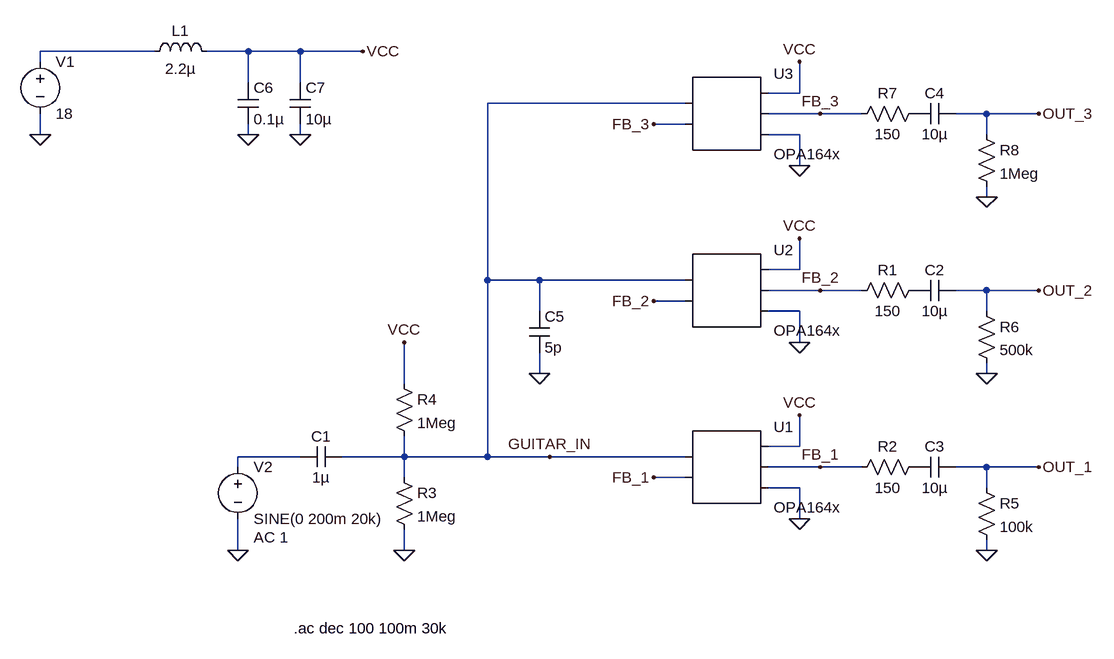
[diagram p0: schematic buffer.asc]
buffer.asc, the LTspice schematic file:
Version 4
SHEET 1 880 680
WIRE -736 -480 -912 -480
WIRE -592 -480 -656 -480
WIRE -512 -480 -592 -480
WIRE -416 -480 -512 -480
WIRE -912 -464 -912 -480
WIRE -592 -432 -592 -480
WIRE -512 -432 -512 -480
WIRE 256 -416 256 -464
WIRE 256 -416 208 -416
WIRE 80 -400 -224 -400
WIRE 288 -384 208 -384
WIRE 352 -384 288 -384
WIRE 544 -384 496 -384
WIRE 624 -384 544 -384
WIRE 80 -368 32 -368
WIRE -912 -352 -912 -384
WIRE -592 -352 -592 -368
WIRE -512 -352 -512 -368
WIRE 256 -352 208 -352
WIRE 544 -352 544 -384
WIRE 256 -304 256 -352
WIRE 544 -256 544 -272
WIRE 256 -144 256 -192
WIRE 256 -144 208 -144
WIRE -224 -128 -224 -400
WIRE -144 -128 -224 -128
WIRE 80 -128 -144 -128
WIRE 288 -112 208 -112
WIRE 352 -112 288 -112
WIRE 544 -112 496 -112
WIRE 624 -112 544 -112
WIRE 80 -96 32 -96
WIRE -144 -80 -144 -128
WIRE 256 -80 208 -80
WIRE 544 -80 544 -112
WIRE 256 -32 256 -80
WIRE -144 16 -144 -16
WIRE 544 16 544 0
WIRE -352 32 -352 -32
WIRE 256 128 256 80
WIRE 256 128 208 128
WIRE -512 144 -608 144
WIRE -352 144 -352 112
WIRE -352 144 -448 144
WIRE -224 144 -224 -128
WIRE -224 144 -352 144
WIRE -128 144 -224 144
WIRE 80 144 -128 144
WIRE -608 160 -608 144
WIRE 288 160 208 160
WIRE 352 160 288 160
WIRE 544 160 496 160
WIRE 624 160 544 160
WIRE -352 176 -352 144
WIRE 80 176 32 176
WIRE 256 192 208 192
WIRE 544 192 544 160
WIRE 256 240 256 192
WIRE -608 288 -608 240
WIRE -352 288 -352 256
WIRE 544 288 544 272
FLAG -912 -352 0
FLAG -416 -480 VCC
FLAG 256 80 VCC
FLAG 256 240 0
FLAG 32 176 FB_1
FLAG 288 160 FB_1
FLAG -608 288 0
FLAG 256 -192 VCC
FLAG 256 -32 0
FLAG 32 -96 FB_2
FLAG 288 -112 FB_2
FLAG -352 288 0
FLAG -352 -32 VCC
FLAG 544 288 0
FLAG 544 16 0
FLAG -128 144 GUITAR_IN
FLAG 256 -464 VCC
FLAG 256 -304 0
FLAG 32 -368 FB_3
FLAG 288 -384 FB_3
FLAG 544 -256 0
FLAG 624 160 OUT_1
FLAG 624 -112 OUT_2
FLAG 624 -384 OUT_3
FLAG -144 16 0
FLAG -592 -352 0
FLAG -512 -352 0
SYMBOL AutoGenerated\\OPA164x 144 160 R0
SYMATTR InstName U1
SYMBOL voltage -912 -480 R0
WINDOW 123 24 44 Left 2
WINDOW 39 0 0 Left 0
SYMATTR InstName V1
SYMATTR Value 18
SYMBOL voltage -608 144 R0
WINDOW 123 24 124 Left 2
WINDOW 39 0 0 Left 0
SYMATTR InstName V2
SYMATTR Value SINE(0 200m 20k)
SYMATTR Value2 AC 1
SYMBOL AutoGenerated\\OPA164x 144 -112 R0
SYMATTR InstName U2
SYMBOL res -368 160 R0
SYMATTR InstName R3
SYMATTR Value 1Meg
SYMBOL res -368 16 R0
SYMATTR InstName R4
SYMATTR Value 1Meg
SYMBOL cap -448 128 R90
WINDOW 0 0 32 VBottom 2
WINDOW 3 32 32 VTop 2
SYMATTR InstName C1
SYMATTR Value 1µ
SYMBOL res 448 -128 R90
WINDOW 0 0 56 VBottom 2
WINDOW 3 32 56 VTop 2
SYMATTR InstName R1
SYMATTR Value 150
SYMBOL res 448 144 R90
WINDOW 0 0 56 VBottom 2
WINDOW 3 32 56 VTop 2
SYMATTR InstName R2
SYMATTR Value 150
SYMBOL cap 496 -128 R90
WINDOW 0 0 32 VBottom 2
WINDOW 3 32 32 VTop 2
SYMATTR InstName C2
SYMATTR Value 10µ
SYMBOL cap 496 144 R90
WINDOW 0 0 32 VBottom 2
WINDOW 3 32 32 VTop 2
SYMATTR InstName C3
SYMATTR Value 10µ
SYMBOL res 528 176 R0
SYMATTR InstName R5
SYMATTR Value 100k
SYMBOL res 528 -96 R0
SYMATTR InstName R6
SYMATTR Value 500k
SYMBOL AutoGenerated\\OPA164x 144 -384 R0
SYMATTR InstName U3
SYMBOL res 448 -400 R90
WINDOW 0 0 56 VBottom 2
WINDOW 3 32 56 VTop 2
SYMATTR InstName R7
SYMATTR Value 150
SYMBOL cap 496 -400 R90
WINDOW 0 0 32 VBottom 2
WINDOW 3 32 32 VTop 2
SYMATTR InstName C4
SYMATTR Value 10µ
SYMBOL res 528 -368 R0
SYMATTR InstName R8
SYMATTR Value 1Meg
SYMBOL cap -160 -80 R0
SYMATTR InstName C5
SYMATTR Value 5p
SYMBOL ind -752 -464 R270
WINDOW 0 32 56 VTop 2
WINDOW 3 5 56 VBottom 2
SYMATTR InstName L1
SYMATTR Value 2.2µ
SYMATTR SpiceLine Rser=10m
SYMBOL cap -608 -432 R0
SYMATTR InstName C6
SYMATTR Value 0.1µ
SYMBOL cap -528 -432 R0
SYMATTR InstName C7
SYMATTR Value 10µ
TEXT -522 408 Left 2 !.ac dec 100 100m 30k

The netlist it stands for:
* buffer.asc
* U1: OPA164x (symbol AutoGenerated\OPA164x not available, pins judged from their places): pin1=GUITAR_IN pin2=FB_1 pin3=VCC pin4=FB_1 pin5=0
V1 N001 0 18
V2 N002 0 SINE(0 200m 20k) AC 1
* U2: OPA164x (symbol AutoGenerated\OPA164x not available, pins judged from their places): pin1=GUITAR_IN pin2=FB_2 pin3=VCC pin4=FB_2 pin5=0
R3 GUITAR_IN 0 1Meg
R4 VCC GUITAR_IN 1Meg
C1 GUITAR_IN N002 1µ
R1 P001 FB_2 150
R2 P002 FB_1 150
C2 OUT_2 P001 10µ
C3 OUT_1 P002 10µ
R5 OUT_1 0 100k
R6 OUT_2 0 500k
* U3: OPA164x (symbol AutoGenerated\OPA164x not available, pins judged from their places): pin1=GUITAR_IN pin2=FB_3 pin3=VCC pin4=FB_3 pin5=0
R7 P003 FB_3 150
C4 OUT_3 P003 10µ
R8 OUT_3 0 1Meg
C5 GUITAR_IN 0 5p
L1 N001 VCC 2.2µ Rser=10m
C6 VCC 0 0.1µ
C7 VCC 0 10µ
.ac dec 100 100m 30k
.backanno
.end